# Altium schematic sheet LEDRing.SchDoc
size A4; Organization: Altium Limited; Address1: L3, 12a Rodborough Rd; Address2: Frenchs Forest; Address3: NSW; Address4: Australia 2086
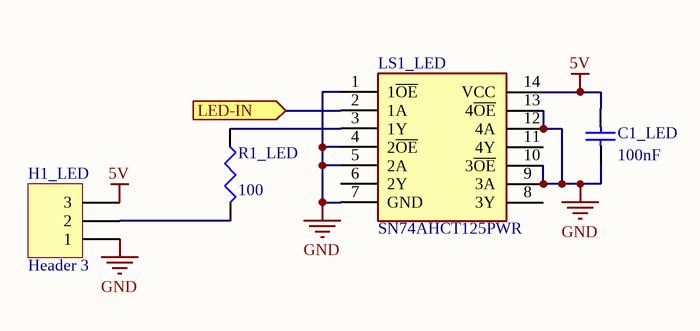
[diagram p0: LEDRing.SchDoc]

## Parts
C1_LED  value 100nF  [1608[0603]]  (hidden comment: Cap Semi)
H1_LED  Header 3  [HDR1X3]
LS1_LED  SN74AHCT125PWR  [SOP65P640X120-14N]
R1_LED  value 100  [J1-0603]  (hidden comment: Res3)

## Ports
LED-IN

## Nets
5V: C1_LED.2 H1_LED.3 LS1_LED.14(VCC)
GND: C1_LED.1 H1_LED.1 LS1_LED.1(1~{OE}) LS1_LED.4(2~{OE}) LS1_LED.5(2A) LS1_LED.7(GND) LS1_LED.9(3A) LS1_LED.10(3~{OE}) LS1_LED.12(4A) LS1_LED.13(4~{OE})
LED-IN: LS1_LED.2(1A) ; port LED-IN
NetH1_LED_2: H1_LED.2 R1_LED.2
NetLS1_LED_3: LS1_LED.3(1Y) R1_LED.1

Not connected (* = marked no-connect by the designer): LS1_LED 6(2Y) 8(3Y) 11(4Y)

## Notes on the sheet
- Title
- Size:
- Date:
- A4
- Number:
- Time:
- Revision:
- Sheet
- of
- File:

## Library data of the parts
C1_LED = Cap Semi: Capacitor (Semiconductor SIM Model); Published: 8-Jun-2000; LatestRevisionDate: 29-May-2009; LatestRevisionNote: IPC-7351 Footprint Added.; PackageReference: C1206; Publisher: Altium Limited; PackageDescription: Chip Capacitor
H1_LED = Header 3: Header, 3-Pin; LatestRevisionDate: 17-Jul-2002; LatestRevisionNote: Re-released for DXP Platform.; Publisher: Altium Limited
LS1_LED = SN74AHCT125PWR: Integrated Circuit; Manufacturer_Name: Texas Instruments; Datasheet Link: http://www.ti.com/lit/gpn/sn74ahct125; Height: 1.2mm; Manufacturer_Part_Number: SN74AHCT125PWR; Mouser Part Number: 595-SN74AHCT125PWR; Mouser Price/Stock: https://www.mouser.com/Search/Refine.aspx?Keyword=595-SN74AHCT125PWR
R1_LED = Res3: Resistor; Published: 8-Jun-2000; LatestRevisionDate: 29-May-2009; LatestRevisionNote: IPC-7351 Footprint Added.; PackageReference: J1-0603; Publisher: Altium Limited; PackageDescription: Chip Resistor